# Altium schematic sheet Power_supply.SchDoc
size A4; SheetNumber: 2; SheetTotal: 3
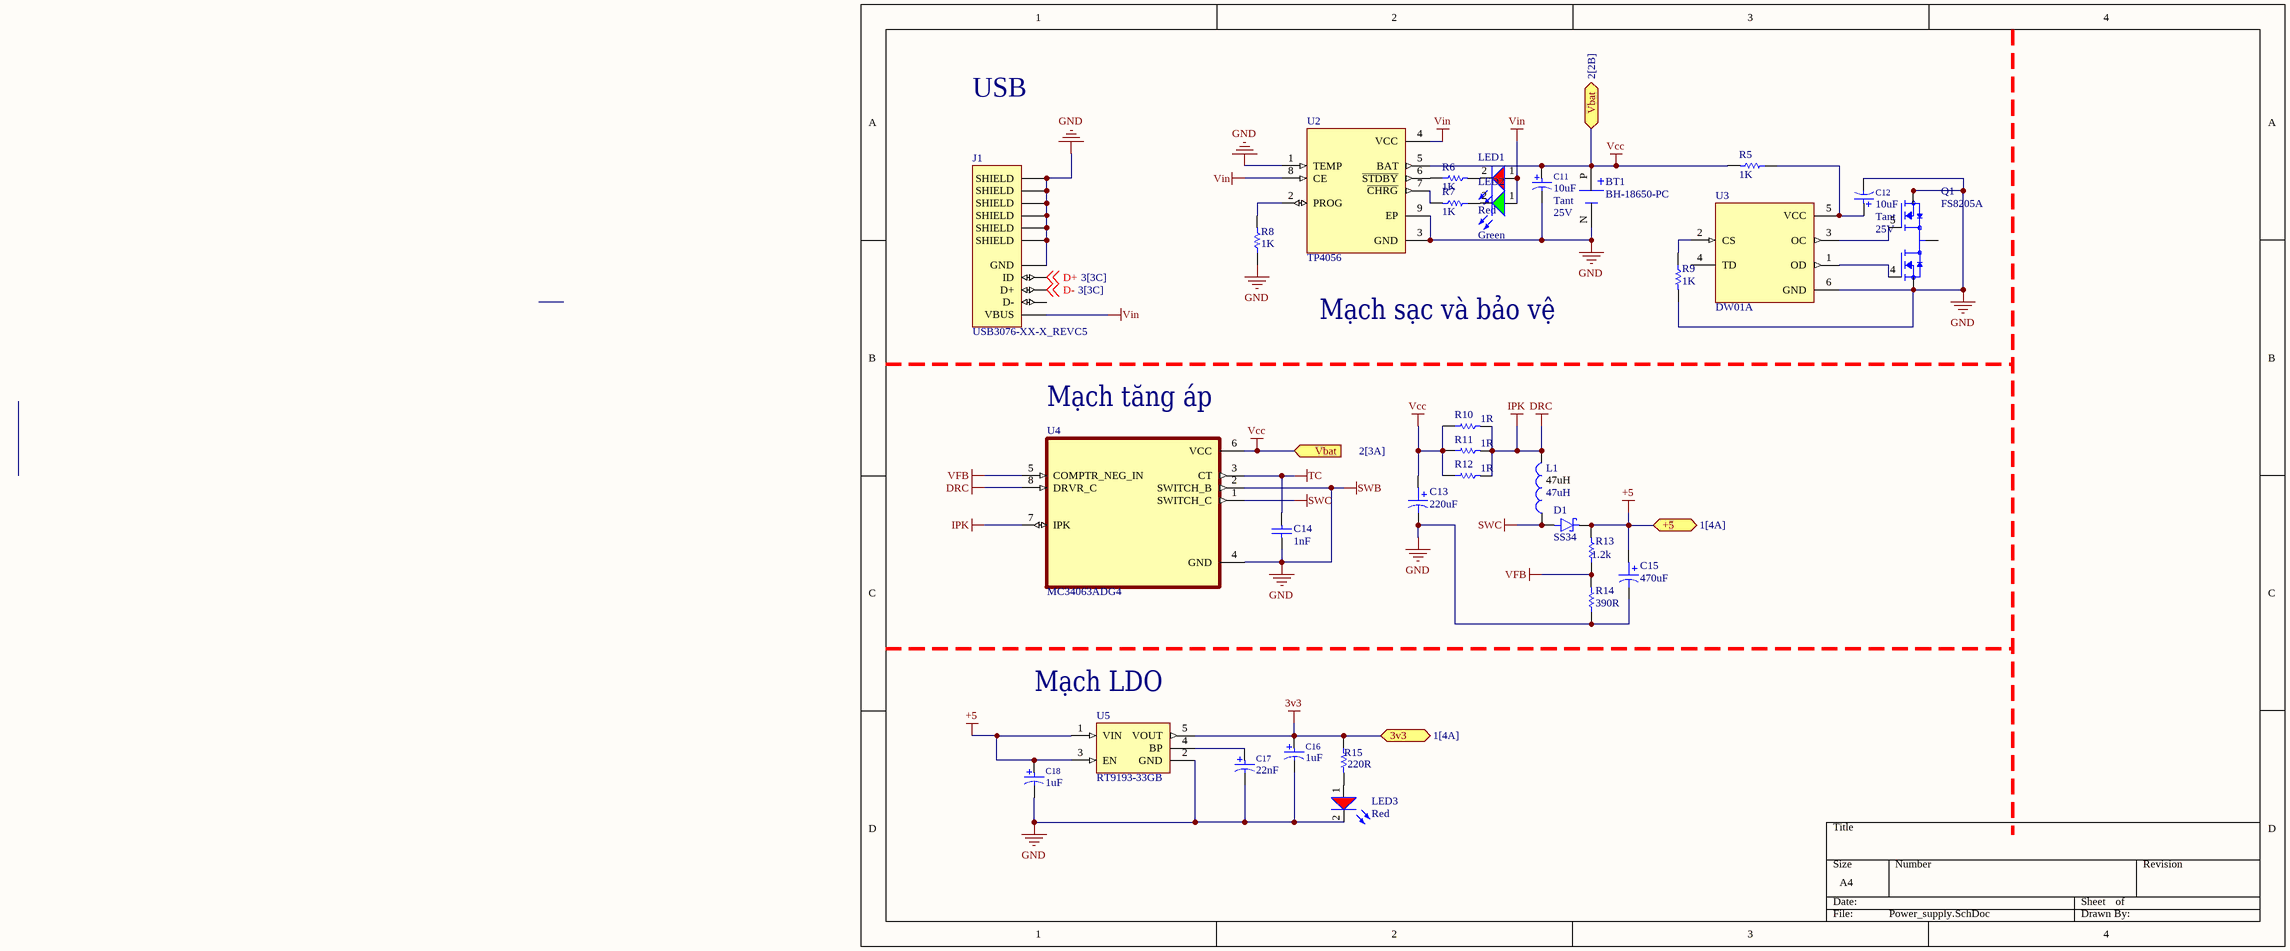
[diagram p0: Power_supply.SchDoc]

## Parts
BT1  BH-18650-PC  [BAT_BH-18650-PC]
C11  Capacitor Type: Tant  Volt: 25V  [C2012-0805]  (hidden comment: 10uF)
C12  Capacitor Type: Tant  Volt: 25V  [C2012-0805]  (hidden comment: 10uF)
C13  value 220uF  [RADIAL B]  (hidden comment: Cap Pol)
C14  value 1nF  [C-NP-0805]  (hidden comment: Cap Non-pol)
C15  value 470uF  [RADIAL C]  (hidden comment: Cap Pol)
C16  1uF  [C2012-0805]
C17  22nF  [C2012-0805]
C18  1uF  [C2012-0805]
D1  SS34  [DIOM7959X265N]
J1  USB3076-XX-X_REVC5  [GCT_USB3076-XX-X_REVC5]
L1  47uH  [IMPE8-RS2]
LED1  value Red  [Led 0805R]  (hidden comment: LED-0805RVC)
LED2  value Green  [Led 0805G]  (hidden comment: LED-0805GVC)
LED3  value Red  [Led 0805R]  (hidden comment: LED-0805RVC)
Q1  FS8205A  [SOP65P640X120-8N]
R5  value 1K  [RES-SM-0805]  (hidden comment: RESISTOR SMD)
R6  value 1K  [RES-SM-0805]  (hidden comment: RESISTOR SMD)
R7  value 1K  [RES-SM-0805]  (hidden comment: RESISTOR SMD)
R8  value 1K  [RES-SM-0805]  (hidden comment: RESISTOR SMD)
R9  value 1K  [RES-SM-0805]  (hidden comment: RESISTOR SMD)
R10  value 1R  [R-0805]  (hidden comment: RESISTOR)
R11  value 1R  [R-0805]  (hidden comment: RESISTOR)
R12  value 1R  [R-0805]  (hidden comment: RESISTOR)
R13  value 1.2k  [R-0805]  (hidden comment: RESISTOR)
R14  value 390R  [R-0805]  (hidden comment: RESISTOR)
R15  value 220R  [RES-SM-0805]  (hidden comment: RESISTOR SMD)
U2  TP4056  [SOP127P600X175-9N]
U3  DW01A  [SOT95P280X145-6N]
U4  MC34063ADG4  [SOIC127P599X175-8N]
U5  RT9193-33GB  [SOT94P279X129-5N]

## Ports
3v3 (bidir, see 1[4A]), +5 (bidir, see 1[4A]), Vbat (bidir, see 2[2B]), Vbat (in, see 2[3A])

## Nets
3v3: C16.1 R15.1 U5.5(VOUT) ; port 3v3
+5: C15.1 C18.1 D1.C(K) R13.2 U5.1(VIN) U5.3(EN) ; port +5
DRC: L1.2 R10.2 R11.2 R12.2 U4.7(IPK) U4.8(DRVR_C)  [also labelled IPK]
GND: BT1.N(NEG) C11.2 C12.2 C13.2 C14.1 C15.2 C16.2 C17.2 C18.2 J1.5(GND) J1.6(SHIELD) J1.7(SHIELD) J1.8(SHIELD) J1.9(SHIELD) J1.10(SHIELD) J1.11(SHIELD) LED3.2(K) Q1.2(S1) Q1.3(S1) Q1.6(S2) Q1.7(S2) R8.1 R9.2 R14.1 U2.1(TEMP) U2.3(GND) U2.9(EP) U3.6(GND) U4.2(SWITCH_B) U4.4(GND) U5.2(GND)  [also labelled SWB]
SWC: D1.A L1.1 U4.1(SWITCH_C)
TC: C14.2 U4.3(CT)
Vcc: BT1.P(POS) C11.1 C13.1 R5.2 R10.1 R11.1 R12.1 U2.5(BAT) U4.6(VCC) ; port Vbat
VFB: R13.1 R14.2 U4.5(COMPTR_NEG_IN)
Vin: J1.1(VBUS) LED1.1(A) LED2.1(A) U2.4(VCC) U2.8(CE)
D+: J1.4(ID) ; off-sheet D+
D-: J1.3(D+) ; off-sheet D-
NetC12_1: C12.1 R5.1 U3.5(VCC)
NetC17_1: C17.1 U5.4(BP)
NetLED1_2: LED1.2(K) R6.2
NetLED2_2: LED2.2(K) R7.1
NetLED3_1: LED3.1(A) R15.2
NetQ1_1: Q1.1(D12) Q1.8(D12)
NetQ1_4: Q1.4(G1) U3.1(OD)
NetQ1_5: Q1.5(G2) U3.3(OC)
NetR6_1: R6.1 U2.6(~{STDBY})
NetR7_2: R7.2 U2.7(~{CHRG})
NetR8_2: R8.2 U2.2(PROG)
NetR9_1: R9.1 U3.2(CS)

Not connected (* = marked no-connect by the designer): J1 2(D-); U3 4(TD)

## Notes on the sheet
- USB
- Mạch sạc và bảo vệ
- (near U4) Mạch tăng áp
- (near U5) Mạch LDO

## Library data of the parts
BT1 = BH-18650-PC: Battery Holder _Open_ 18650 1 Cell PC Pin; MF: MPD _Memory; Package: DFN-8 Memory Protection Devices; MP: BH-18650-PC; Value: *; Availability: Unavailable; SnapEDA_Link: https://www.snapeda.com/parts/BH-18650-PC/MPD%20%28Memory%20Protection%20Devices%29/view-part/779074/?ref=snap; Price: None
C11 C12 C16-C18 = Cap_Pol: Polarized Capacitor; Manufacturer: FARNELL; AEMS Code: 2100110; Vendor: Digikey; Published: 13-April-2009; Publisher: Hoang Nguyen; ComponentLink1Description: Digikey Part Link; ComponentLink2Description: Open Datasheet; ComponentLink2URL: H:\LIBRARY\LIBRARY.Datasheet\
  C11 C12: Value: 10uF
  C16 C18: Value: 1uF
  C17: Value: 22nF
C13 C15 = Cap Pol: Polarized Capacitor; Published: 8-Jun-2000; LatestRevisionDate: 17-Jul-2002; LatestRevisionNote: Re-released for DXP Platform.; PackageReference: POLAR0.8; Publisher: Altium Limited
C14 = Cap Non-pol: Non-polarized Capacitor; Published: 8-Jun-2000; LatestRevisionDate: 17-Jul-2002; LatestRevisionNote: Re-released for DXP Platform.; PackageReference: RAD-0.3; Publisher: Altium Limited
D1 = SS34: Diode Schottky 40 V 3A Surface Mount SMC (DO-214AB); MF: onsemi; SnapEDA_Link: https://www.snapeda.com/parts/SS34/Onsemi/view-part/?ref=snap; Package: SMC-2 ON Semiconductor; Value: *; MP: SS34; Check_prices: https://www.snapeda.com/parts/SS34/Onsemi/view-part/?ref=eda
J1 = USB3076-XX-X_REVC5: USB - micro B USB 2.0 Receptacle Connector 5 Position Surface Mount, Right Angle; Through Hole, 2.35mm profile, 5 Pins, Horizontal, Bottom mount; MP: USB3076-30-A; MF: Global Connector Technology; SnapEDA_Link: https://www.snapeda.com/parts/USB3076-30-A/Global+Connector+Technology/view-part/?ref=snap; Package: None; Check_prices: https://www.snapeda.com/parts/USB3076-30-A/Global+Connector+Technology/view-part/?ref=eda; Purchase-URL: https://pricing.snapeda.com/search/part/USB3076-30-A/?ref=eda; Price: None; Value: *; Availability: In Stock
L1 = Inductor_1: Cuon Cam L; Code_IEC: 1005; Vendor: Digikey; Published: 8-Jun-2000; LatestRevisionDate: 17-Jul-2002; LatestRevisionNote: Re-released for DXP Platform.; PackageReference: 0402-A; Publisher: Altium Limited; Code_JEITA: 0402; ComponentLink1Description: Digikey Part Link; ComponentLink2Description: Open Datasheet; ComponentLink2URL: H:\LIBRARY\LIBRARY.Datasheet\; Value: 47uH
LED1 LED3 = LED-0805RVC: LED Red 2mA 1.8V 0805; ComponentLink1Description: Datasheet; ComponentLink1URL: D:\Dropbox\Datasheets\Opto and Illumination\LEDs\SMD LED.pdf; Unit Price: 0.0476
LED2 = LED-0805GVC: LED Green 2mA 3V 0805; ComponentLink1Description: Datasheet; ComponentLink1URL: D:\Dropbox\Datasheets\Opto and Illumination\LEDs\SMD LED.pdf; Unit Price: 0.0476
Q1 = FS8205A: N/A; MF: Fortune Semiconductor; MP: FS8205A; Value: *; Availability: Not in stock; Package: Package; Price: None; SnapEDA_Link: https://www.snapeda.com/parts/FS8205A/Fortune+Semiconductor/view-part/?ref=snap; Check_prices: https://www.snapeda.com/parts/FS8205A/Fortune+Semiconductor/view-part/?ref=eda
R5-R9 R15 = RESISTOR SMD: Resistor
U2 = TP4056: Complete single cell Li-Ion battery with a constant current / constant voltage linear charger; MF: NanJing Top Power ASIC Corp.; Check_prices: https://www.snapeda.com/parts/TP4056/NanJing+Top+Power+ASIC+Corp./view-part/?ref=eda; SnapEDA_Link: https://www.snapeda.com/parts/TP4056/NanJing+Top+Power+ASIC+Corp./view-part/?ref=snap; Price: None; Availability: Not in stock; Package: Package; MP: TP4056; Value: *
U3 = DW01A: One Cell Lithium-ion/Polymer Battery Protection IC; MF: Fortune Semiconductor; SnapEDA_Link: https://www.snapeda.com/parts/DW01A/Fortune+Semiconductor/view-part/?ref=snap; Package: SOT-23-6 Fortune Semiconductor; Value: *; MP: DW01A; Check_prices: https://www.snapeda.com/parts/DW01A/Fortune+Semiconductor/view-part/?ref=eda
U5 = RT9193-33GB: Linear Voltage Regulator IC Positive Fixed 1 Output 300mA TSOT-23-5; MF: Richtek USA; SnapEDA_Link: https://www.snapeda.com/parts/RT9193-33GB/Richtek+USA+Inc./view-part/?ref=snap; Package: SOT-23-5 Richtek; MP: RT9193-33GB; Check_prices: https://www.snapeda.com/parts/RT9193-33GB/Richtek+USA+Inc./view-part/?ref=eda; Purchase-URL: https://pricing.snapeda.com/search/part/RT9193-33GB/?ref=eda; Digi-Key_Part_Number: 1028-1014-2-ND; Value: *
R10-R14 = RESISTOR: Published: 8-Jun-2000; LatestRevisionDate: 17-Jul-2002; LatestRevisionNote: Re-released for DXP Platform.; PackageReference: AXIAL-0.3; Publisher: Altium Limited
U4 = MC34063ADG4: Package: None; Price: None; Value: *; MP: MC34063ADG4; Availability: Unavailable